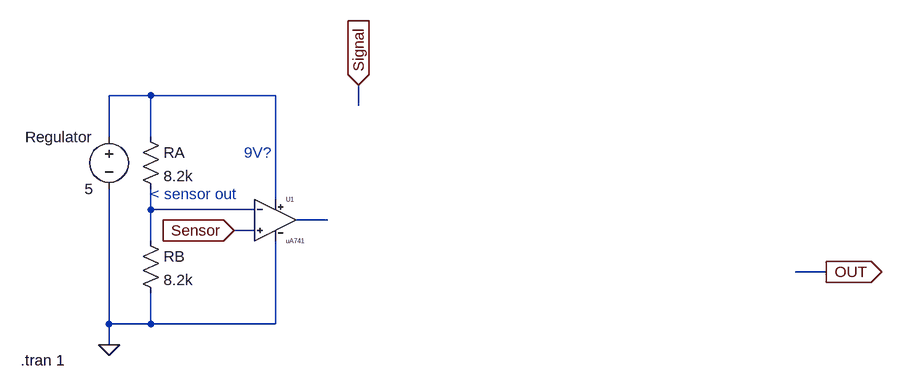
[diagram p0: schematic Sensor.asc]
Sensor.asc, the LTspice schematic file:
Version 4.1
SHEET 1 1196 680
WIRE 48 0 -16 0
WIRE 240 0 48 0
WIRE 368 16 368 -16
WIRE -16 64 -16 0
WIRE 48 64 48 0
WIRE 240 160 240 0
WIRE 48 176 48 144
WIRE 208 176 48 176
WIRE 320 192 272 192
WIRE 208 208 176 208
WIRE 48 224 48 176
WIRE 1088 272 1040 272
WIRE -16 352 -16 144
WIRE 48 352 48 304
WIRE 48 352 -16 352
WIRE 240 352 240 224
WIRE 240 352 48 352
WIRE -16 384 -16 352
FLAG -16 384 0
FLAG 1088 272 OUT
IOPIN 1088 272 Out
FLAG 368 -16 Signal
IOPIN 368 -16 In
FLAG 176 208 Sensor
IOPIN 176 208 In
SYMBOL res 32 48 R0
SYMATTR InstName RA
SYMATTR Value 8.2k
SYMBOL res 32 208 R0
SYMATTR InstName RB
SYMATTR Value 8.2k
SYMBOL voltage -16 48 M0
SYMATTR InstName Regulator
SYMATTR Value 5
SYMBOL uA741 240 128 R0
SYMATTR InstName U1
TEXT 192 88 Left 2 ;9V?
TEXT 48 152 Left 2 ;< sensor out
TEXT -152 408 Left 2 !.tran 1

The netlist it stands for:
* Sensor.asc
RA N001 N002 8.2k
RB N002 0 8.2k
V§Regulator N001 0 5
X§U1 Sensor N002 N001 0 N003 uA741  ; pins In+ In- V+ V- OUT
* 9V?
* < sensor out
.tran 1
.lib uA741.sub
.backanno
.end